# Altium schematic sheet Bridge.SchDoc
size Letter
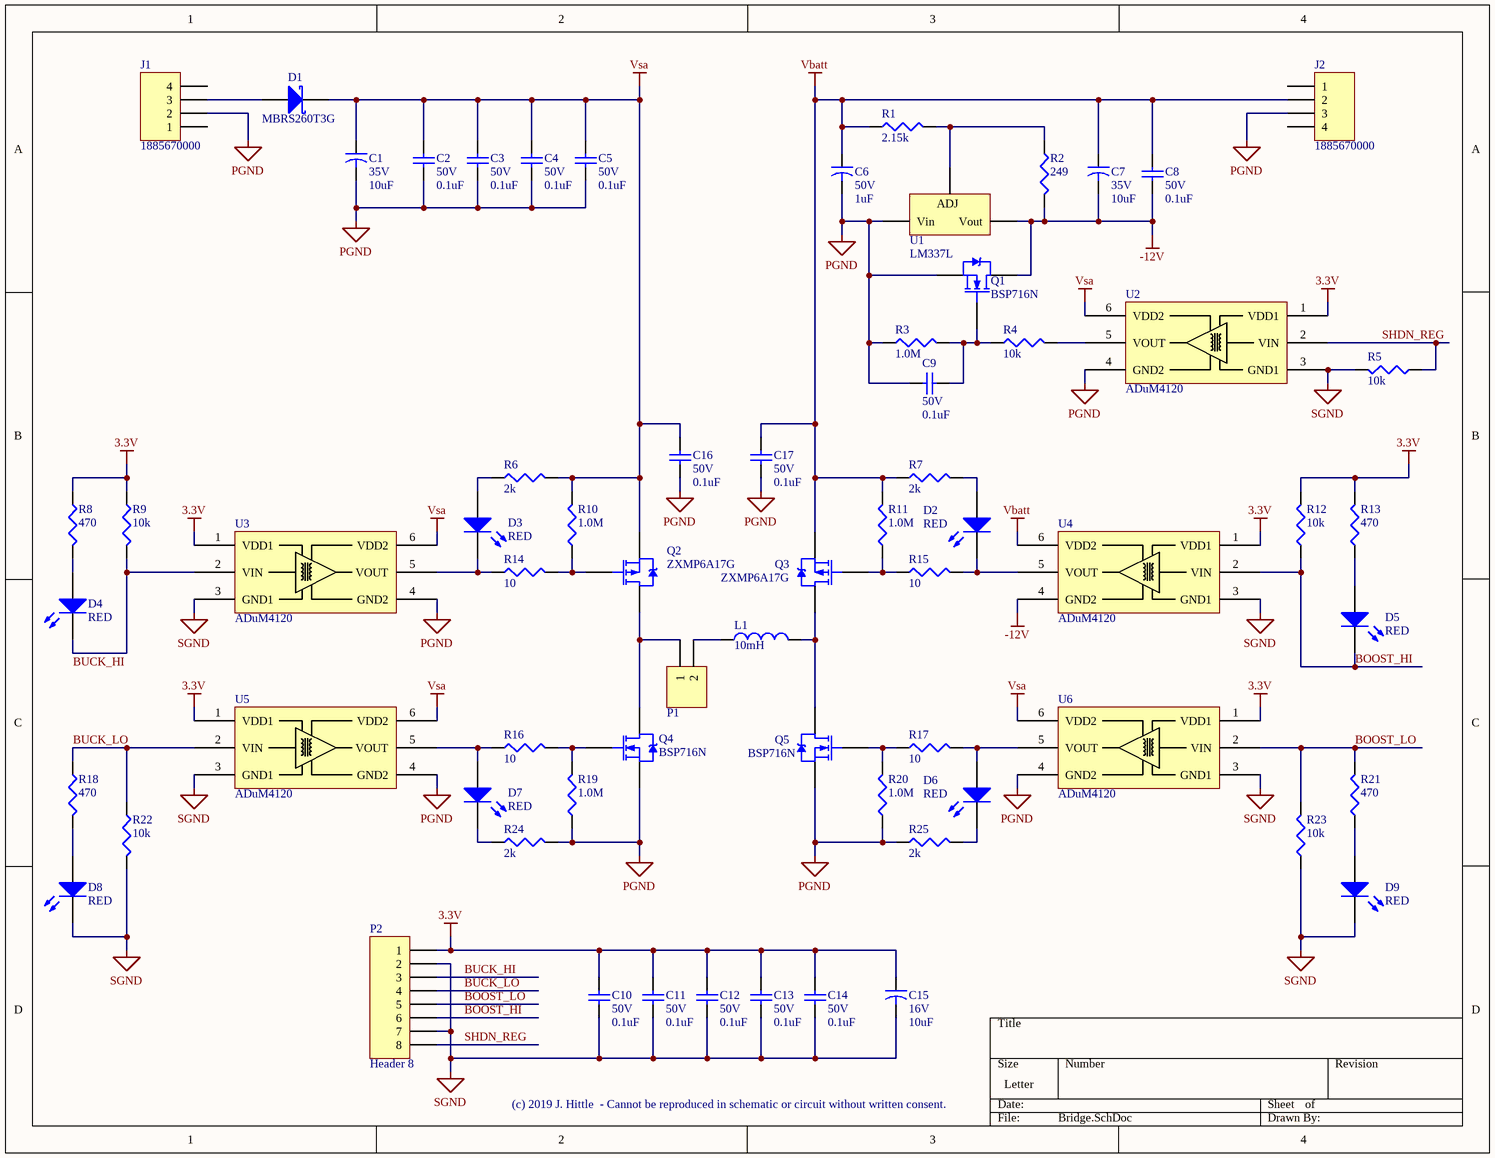
[diagram p0: Bridge.SchDoc]

## Parts
C1  value 10uF  Voltage: 35V  [C2312 Tantalum]  (hidden comment: Cap Polarized)
C2  value 0.1uF  Voltage: 50V  [C0805]  (hidden comment: Cap Chip)
C3  value 0.1uF  Voltage: 50V  [C0805]  (hidden comment: Cap Chip)
C4  value 0.1uF  Voltage: 50V  [C0805]  (hidden comment: Cap Chip)
C5  value 0.1uF  Voltage: 50V  [C0805]  (hidden comment: Cap Chip)
C6  value 1uF  Voltage: 50V  [C2312 Tantalum]  (hidden comment: Cap Polarized)
C7  value 10uF  Voltage: 35V  [C2312 Tantalum]  (hidden comment: Cap Polarized)
C8  value 0.1uF  Voltage: 50V  [C0805]  (hidden comment: Cap Chip)
C9  value 0.1uF  Voltage: 50V  [C0603]  (hidden comment: Cap Chip)
C10  value 0.1uF  Voltage: 50V  [C0805]  (hidden comment: Cap Chip)
C11  value 0.1uF  Voltage: 50V  [C0805]  (hidden comment: Cap Chip)
C12  value 0.1uF  Voltage: 50V  [C0805]  (hidden comment: Cap Chip)
C13  value 0.1uF  Voltage: 50V  [C0805]  (hidden comment: Cap Chip)
C14  value 0.1uF  Voltage: 50V  [C0805]  (hidden comment: Cap Chip)
C15  value 10uF  Voltage: 16V  [C1206 Tantalum]  (hidden comment: Cap Polarized)
C16  value 0.1uF  Voltage: 50V  [C0603]  (hidden comment: Cap Chip)
C17  value 0.1uF  Voltage: 50V  [C0603]  (hidden comment: Cap Chip)
D1  MBRS260T3G  [SMB]
D2  RED  [0603_LED_Red]
D3  RED  [0603_LED_Red]
D4  RED  [0603_LED_Red]
D5  RED  [0603_LED_Red]
D6  RED  [0603_LED_Red]
D7  RED  [0603_LED_Red]
D8  RED  [0603_LED_Red]
D9  RED  [0603_LED_Red]
J1  1885670000  [1885670000]
J2  1885670000  [1885670000]
L1  value 10mH  [141060XC]  (hidden comment: Inductor)
P1  (no value)  [HDR1X2]
P2  Header 8  [HDR1X8]
Q1  BSP716N  [SOT223]
Q2  ZXMP6A17G  [SOT223]
Q3  ZXMP6A17G  [SOT223]
Q4  BSP716N  [SOT223]
Q5  BSP716N  [SOT223]
R1  value 2.15k  [R0805]  (hidden comment: Resistor_Chip)
R2  value 249  [R0603]  (hidden comment: Resistor_Chip)
R3  value 1.0M  [R0603]  (hidden comment: Resistor_Chip)
R4  value 10k  [R0603]  (hidden comment: Resistor_Chip)
R5  value 10k  [R0603]  (hidden comment: Resistor_Chip)
R6  value 2k  [R0603]  (hidden comment: Resistor_Chip)
R7  value 2k  [R0603]  (hidden comment: Resistor_Chip)
R8  value 470  [R0603]  (hidden comment: Resistor_Chip)
R9  value 10k  [R0603]  (hidden comment: Resistor_Chip)
R10  value 1.0M  [R0603]  (hidden comment: Resistor_Chip)
R11  value 1.0M  [R0603]  (hidden comment: Resistor_Chip)
R12  value 10k  [R0603]  (hidden comment: Resistor_Chip)
R13  value 470  [R0603]  (hidden comment: Resistor_Chip)
R14  value 10  [R1206]  (hidden comment: Resistor_Chip)
R15  value 10  [R1206]  (hidden comment: Resistor_Chip)
R16  value 10  [R1206]  (hidden comment: Resistor_Chip)
R17  value 10  [R1206]  (hidden comment: Resistor_Chip)
R18  value 470  [R0603]  (hidden comment: Resistor_Chip)
R19  value 1.0M  [R0603]  (hidden comment: Resistor_Chip)
R20  value 1.0M  [R0603]  (hidden comment: Resistor_Chip)
R21  value 470  [R0603]  (hidden comment: Resistor_Chip)
R22  value 10k  [R0603]  (hidden comment: Resistor_Chip)
R23  value 10k  [R0603]  (hidden comment: Resistor_Chip)
R24  value 2k  [R0603]  (hidden comment: Resistor_Chip)
R25  value 2k  [R0603]  (hidden comment: Resistor_Chip)
U1  LM337L  [TO-92A]
U2  ADuM4120  [SOIC RI-6-1]
U3  ADuM4120  [SOIC RI-6-1]
U4  ADuM4120  [SOIC RI-6-1]
U5  ADuM4120  [SOIC RI-6-1]
U6  ADuM4120  [SOIC RI-6-1]

## Nets
3.3V: C10.2 C11.2 C12.2 C13.2 C14.2 C15.1 P2.1 R8.2 R9.2 R12.2 R13.2 U2.1(VDD1) U3.1(VDD1) U4.1(VDD1) U5.1(VDD1) U6.1(VDD1)
-12V: C7.2 C8.1 Q1.D R2.2 U1.Vout U4.4(GND2)
PGND: C1.2 C2.1 C3.1 C4.1 C5.1 C6.2 C9.2 C16.1 C17.1 J1.2 J2.3 Q1.S Q4.S Q5.S R3.1 R19.1 R20.1 R24.2 R25.1 U1.Vin U2.4(GND2) U3.4(GND2) U5.4(GND2) U6.4(GND2)
SGND: C10.1 C11.1 C12.1 C13.1 C14.1 C15.2 D8.2(K) D9.2(K) P2.2 P2.7 R5.2 R22.1 R23.1 U2.3(GND1) U3.3(GND1) U4.3(GND1) U5.3(GND1) U6.3(GND1)
Vbatt: C6.1 C7.1 C8.2 C17.2 J2.2 Q3.S R1.1 R7.1 R11.2 U4.6(VDD2)
Vsa: C1.1 C2.2 C3.2 C4.2 C5.2 C16.2 D1.2(K) Q2.S R6.1 R10.2 U2.6(VDD2) U3.6(VDD2) U5.6(VDD2) U6.6(VDD2)
BOOST_HI: D5.2(K) P2.6 R12.1 U4.2(VIN)
BOOST_LO: P2.5 R21.2 R23.2 U6.2(VIN)
BUCK_HI: D4.2(K) P2.3 R9.1 U3.2(VIN)
BUCK_LO: P2.4 R18.2 R22.2 U5.2(VIN)
SHDN_REG: P2.8 R5.1 U2.2(VIN)
NetC9_1: C9.1 Q1.G R3.2 R4.1
NetD1_1: D1.1(A) J1.3
NetD2_1: D2.1(A) R7.2
NetD2_2: D2.2(K) R15.2 U4.5(VOUT)
NetD3_1: D3.1(A) R6.2
NetD3_2: D3.2(K) R14.1 U3.5(VOUT)
NetD4_1: D4.1(A) R8.1
NetD5_1: D5.1(A) R13.1
NetD6_1: D6.1(A) R17.2 U6.5(VOUT)
NetD6_2: D6.2(K) R25.2
NetD7_1: D7.1(A) R16.1 U5.5(VOUT)
NetD7_2: D7.2(K) R24.1
NetD8_1: D8.1(A) R18.1
NetD9_1: D9.1(A) R21.1
NetL1_1: L1.1 P1.2
NetL1_2: L1.2 Q3.D Q5.D
NetP1_1: P1.1 Q2.D Q4.D
NetQ2_G: Q2.G R10.1 R14.2
NetQ3_G: Q3.G R11.1 R15.1
NetQ4_G: Q4.G R16.2 R19.2
NetQ5_G: Q5.G R17.1 R20.2
NetR1_2: R1.2 R2.1 U1.GND
NetR4_2: R4.2 U2.5(VOUT)

Not connected (* = marked no-connect by the designer): J1 1 4; J2 1 4

## Notes on the sheet
- (c) 2019 J. Hittle  - Cannot be reproduced in schematic or circuit without written consent.
- (in symbol Neg Volt Reg - Adj) ADJ

## Library data of the parts
C1 C7 = Cap Polarized: Capacitor, 600mohm, 200mA@100kHz; Part Number: TRJC106K035R0600; Current: *; Power: *; 1k Price: *
C2-C5 C8 C10-C14 = Cap Chip: Capacitor; Part Number: CL21B104KBCNNNC; Current: *; Power: *; 1k Price: *
C6 = Cap Polarized: Capacitor, 600mohm, 200mA@100kHz; Part Number: TAJC105K050RNJ; Current: *; Power: *; 1k Price: *
C9 C16 C17 = Cap Chip: Capacitor; Part Number: CL10B104KB8NNNC; Current: *; Power: *; 1k Price: *
C15 = Cap Polarized: Capacitor, 600mohm, 200mA@100kHz; Part Number: TAJA106K016RNJV; Current: *; Power: *; 1k Price: *
D1 = D Schottky: Schottky Diode; Published: 8-Jun-2000; LatestRevisionDate: 17-Jul-2002; LatestRevisionNote: Re-released for DXP Platform.; PackageReference: SMB; Publisher: Altium Limited; PackageDescription: DO-214-AA/SMB; 2 C-Bend Leads; Body 5.3 x 3.6 mm, inc. leads (LxW); Part Number: MBRS260T3G
D2-D9 = LED0: Red LED; Part Number: LTST-C193KRKT-5A; Published: 8-Jun-2000; LatestRevisionDate: 08-Jul-2005; LatestRevisionNote: Mech Layer 1 removed.; PackageReference: LED-0; Publisher: Altium Limited; PackageDescription: LED; 2 Leads
J1 J2 = 1885670000: TERM BLOCK 4POS 45DEG 3.5MM PCB; Voltage: 300V; Current: 12A; 1k Price: 0.85073; ComponentLink1Description: Digikey; ComponentLink1URL: https://www.digikey.com/product-detail/en/1885670000/281-2811-ND/2410728?utm_campaign=buynow&WT.z_cid=ref_octopart_dkc_buynow&utm_medium=aggregator&curr=usd&site=us&utm_source=octopart; ComponentLink2Description: Datasheet; ComponentLink2URL: https://media.digikey.com/pdf/Data%20Sheets/Weidmuller%20PDFs/1885670000.pdf; Part Number: 1885670000; Power: *; Value: *
L1 = Inductor: Part Number: 1410606C or 1410604C; Code_IEC: 1005; Published: 8-Jun-2000; LatestRevisionDate: 29-May-2009; LatestRevisionNote: IPC-7351 Footprint Added.; PackageReference: 0402-A; Publisher: Altium Limited; PackageDescription: Chip Inductor; Code_JEITA: 0402
P1 = Header 2: Header, 2-Pin, 100mil; LatestRevisionDate: 17-Jul-2002; LatestRevisionNote: Re-released for DXP Platform.; Publisher: Altium Limited
P2 = Header 8: Header, 8-Pin, 100mil; LatestRevisionDate: 17-Jul-2002; LatestRevisionNote: Re-released for DXP Platform.; Publisher: Altium Limited
Q1 Q4 Q5 = NMOS: N-Channel MOSFET; pin to pad: D>2 G>1 S>3; Part Number: BSP716NH6327XTSA1; Voltage: *; Current: *; Value: *; Power: *; 1k Price: *
Q2 Q3 = PMOS: P-Channel MOSFET; pin to pad: D>2 G>1 S>3; Part Number: ZXMP6A17GTA; 1k Price: *; Voltage: *; Value: *; Current: *; Power: *
R1 = Resistor_Chip: Resistor; Part Number: RC0805FR-072K15L; Power: 0.125; 1K Price: *; Voltage: *; Parameter 1: *
R2 = Resistor_Chip: Resistor; Part Number: RC0603FR-07249RL; Power: 0.100; 1K Price: *; Voltage: *; Parameter 1: *
R3 R10 R11 R19 R20 = Resistor_Chip: Resistor; Part Number: RC0603FR-071ML; Power: 0.100; 1K Price: *; Voltage: *; Parameter 1: *
R4 R5 R9 R12 R22 R23 = Resistor_Chip: Resistor; Part Number: RC0603FR-0710KL; Power: 0.100; 1K Price: *; Voltage: *; Parameter 1: *
R6 R7 R24 R25 = Resistor_Chip: Resistor; Part Number: RC0805FR-072KL; Power: 0.125; 1K Price: *; Voltage: *; Parameter 1: *
R8 R13 R18 R21 = Resistor_Chip: Resistor; Part Number: RC0603FR-07470RL; Power: 0.100; 1K Price: *; Voltage: *; Parameter 1: *
R14-R17 = Resistor_Chip: Resistor; Part Number: RC1206FR-0710RL; Power: 0.250; 1K Price: *; Voltage: *; Parameter 1: *
U1 = Neg Volt Reg - Adj: Negative Voltage Regulator; pin to pad: GND>1 Vin>3 Vout>2; Part Number: LM337LZ/NOPB; Voltage: *; Value: *; Current: *; Power: *; 1k Price: *
U2-U6 = ADuM4120: Isolated Gate-Driver; Part Number: ADuM4120-1ARIZ